# Altium schematic sheet Smartfin Main PCBA Motion.SchDoc
size Letter; TOCFontName: Consolas; TOCFontSize: 24; TOCFontColor: 0; TOCFontAttributes: 0; TOCMaxLinesInTable: 25; TOCVerticalOffset: 200; TOCHorizontalOffset: 500; TOCHorizontalSeparation: 800; TOCVerticalSeparation: 30; TOCHorizTableSize: 640; PageSetup: Record=PageOptions|CenterHorizontal=True|CenterVertical=True|PrintScale=0.96|XCorrection=1.00|YCorrection=1.00|PrintKind=0|BorderSize=5000000|LeftOffset=0|BottomOffset=0|Orientation=2|PaperLength=1000|PaperWidth=1000|Scale=100|PaperSource=7|PrintQuality=-4|MediaType=1|DitherType=10|PaperKind=11" x 17"|PrintScaleMode=1; SheetNumber: 4; SheetTotal: 8
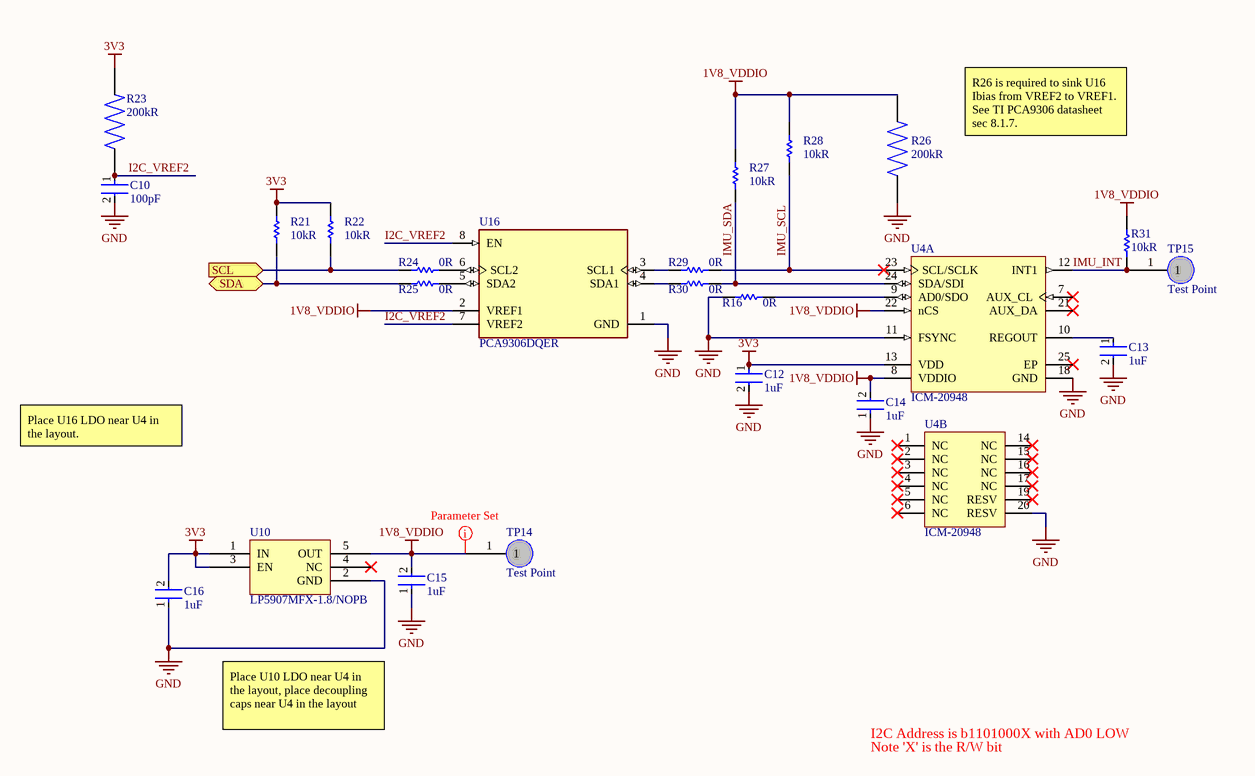
[diagram p0: Smartfin Main PCBA Motion.SchDoc]

## Parts
C10  value 100pF  [CAPC1005X06N]  (hidden comment: CC0402KRX7R9BB101)
C12  value 1uF  [FP-CC0402-IPC_C]  (hidden comment: cc0402krx5r6bb105)
C13  value 1uF  [FP-CC0402-IPC_C]  (hidden comment: cc0402krx5r6bb105)
C14  value 1uF  [FP-CC0402-IPC_C]  (hidden comment: cc0402krx5r6bb105)
C15  value 1uF  [FP-CC0402-IPC_C]  (hidden comment: cc0402krx5r6bb105)
C16  value 1uF  [FP-CC0402-IPC_C]  (hidden comment: cc0402krx5r6bb105)
R16  value 0R  [RESC1005X04N]  (hidden comment: RC0402JR-070RL)
R21  value 10kR  [RESC1005X04N]  (hidden comment: RC0402FR-0710KL)
R22  value 10kR  [RESC1005X04N]  (hidden comment: RC0402FR-0710KL)
R23  value 200kR  [RESC1005X04N]  (hidden comment: RC0402JR-07200KL)
R24  value 0R  [RESC1005X04N]  (hidden comment: RC0402JR-070RL)
R25  value 0R  [RESC1005X04N]  (hidden comment: RC0402JR-070RL)
R26  value 200kR  [RESC1005X04N]  (hidden comment: RC0402JR-07200KL)
R27  value 10kR  [RESC1005X04N]  (hidden comment: RC0402FR-0710KL)
R28  value 10kR  [RESC1005X04N]  (hidden comment: RC0402FR-0710KL)
R29  value 0R  [RESC1005X04N]  (hidden comment: RC0402JR-070RL)
R30  value 0R  [RESC1005X04N]  (hidden comment: RC0402JR-070RL)
R31  value 10kR  [RESC1005X04N]  (hidden comment: RC0402FR-0710KL)
TP14  Test Point  [New footprint 1]
TP15  Test Point  [New footprint 1]
U4  ICM-20948  [TDK-QFN-24_L]  (parts A,B of 2)
U10  LP5907MFX-1.8/NOPB  [SOT95P280X145-5N]
U16  PCA9306DQER  [FP-DQE0008A-MFG]

## Ports
SCL (in), SDA (bidir)

## Nets
1V8_VDDIO: C14.2 C15.2 R26.2 R27.2 R28.2 R31.2 TP14.1 U4.8(VDDIO) U4.22(nCS) U10.5(OUT) U16.2(VREF1)
3V3: C12.1 C16.2 R21.2 R22.2 R23.2 U4.13(VDD) U10.1(IN) U10.3(EN)
GND: C10.2 C12.2 C13.2 C14.1 C15.1 C16.1 R16.1 R26.1 U4.11(FSYNC) U4.18(GND) U4.20(RESV) U10.2(GND) U16.1(GND)
I2C_VREF2: C10.1 R23.1 U16.7(VREF2) U16.8(EN)
IMU_INT: R31.1 TP15.1 U4.12(INT1)
IMU_SCL: R28.1 R29.2 U4.23(SCL/SCLK)
IMU_SDA: R27.1 R30.2 U4.24(SDA/SDI)
SCL: R22.1 R24.1 ; port SCL
SDA: R21.1 R25.1 ; port SDA
NetC13_1: C13.1 U4.10(REGOUT)
NetR16_2: R16.2 U4.9(AD0/SDO)
NetR24_2: R24.2 U16.6(SCL2)
NetR25_2: R25.2 U16.5(SDA2)
NetR29_1: R29.1 U16.3(SCL1)
NetR30_1: R30.1 U16.4(SDA1)

Not connected (* = marked no-connect by the designer): U4 1(NC)* 2(NC)* 3(NC)* 4(NC)* 5(NC)* 6(NC)* 7(AUX_CL)* 14(NC)* 15(NC)* 16(NC)* 17(NC)* 19(RESV)* 21(AUX_DA)* 25(EP)*; U10 4(NC)*

## Layout directives
rule Supply Nets [Voltage = 1.800]; net class POWER: 1V8_VDDIO

## Notes on the sheet
- R26 is required to sink U16 Ibias from VREF2 to VREF1. See TI PCA9306 datasheet sec 8.1.7.
- Place U16 LDO near U4 in the layout.
- Place U10 LDO near U4 in the layout, place decoupling caps near U4 in the layout
- I2C Address is b1101000X with AD0 LOW
- Note 'X' is the R/W bit

## Library data of the parts
C10 = YAGEO-CC0402KRX7R9BB101-3: Ceramic Capacitor, Multilayer, Ceramic, 50V, 10% +Tol, 10% -Tol, X7R, 15% TC, 0.0001uF, Surface Mount, 0402
C12-C16 = YAGEO-CC0402KRX5R6BB105-1: Ceramic Capacitor, Multilayer, Ceramic, 10V, 10% +Tol, 10% -Tol, X5R, 15% TC, 1uF, Surface Mount, 0402
R16 R24 R25 R29 R30 = YAGEO-RC0402JR-070RL-1: Metal Glaze/thick Film, 0.0625W, 0ohm, Surface Mount, 0402
R21 R22 R27 R28 R31 = CMP-002-000053-2: Fixed Resistor, Metal Glaze/thick Film, 0.0625W, 10000ohm, 50V, 1% +/-Tol, 100ppm/Cel, Surface Mount, 0402
R23 R26 = CMP-002-000016-2: Res Thick Film 0402 200K Ohm 5% 0.063W(1/16W) ?100ppm/C Molded SMD Paper T/R; MF: {'manufacturer': u'YAGEO'}; Component Type: Standard; Source: RC0402JR-07200KL.SchLib; MP: RC0402JR-07200KL; Pin Count: 2; Price: None; Availability: Unavailable; Package: None; Design Item ID: RC0402JR-07200KL
TP14 TP15 = CMP-00002-11
U4 = CMP-002-000006-5: 9-Axis MEMS MotionTracking Device Gyroscope/Accelerometer/Compass Digital Motion Processor 24-Pin QFN; Pin Count: 24; Component Type: Standard; Source: ICM-20948.SchLib; MP: ICM-20948; Package: None; Design Item ID: ICM-20948; Availability: Unavailable; Value: *; Price: None
U10 = CMP-002-000011-4: 250-mA, low-noise, high-PSRR, low-IQ, ultra-low-dropout voltage regulator with low-IQ and enable 5-SOT-23 -40 to 125; Qualification Status: Not Qualified; Adjustability: FIXED; Number of Outputs: 1; Output Voltage1-Min: 1.764V; Regulator Type: FIXED POSITIVE SINGLE OUTPUT LDO REGULATOR; Output Voltage1-Nom: 1.8V; Min Input Voltage: 2.2V; Output Voltage1-Max: 1.836V; Package Body Material: Plastic; Package Equivalence Code: TSOP5/6,.11,37; Dropout Voltage1-Max: 250mV; Output Current1-Max: 250mA; Max Supply Voltage: 5.5V; Voltage Tolerance-Max: 2%; Input Voltage Absolute-Max: 6V; Price: None; Design Item ID: LP5907MFX-1.8/NOPB; Component Type: Standard; Value: *; Pin Count: 5; Source: LP5907MFX-1.8_NOPB.SchLib; Availability: Unavailable; MP: LP5907MFX-1.8/NOPB; Package: None; Terminal Finish: Tin; Moisture Sensitivity Level: 1; Height - Seated (Max): 1.45mm; Packaging: Tape and Reel; Width: 1.6mm; Package Shape: Rectangular; Pins: 5; Terminal Pitch: 0.95mm; Operating Temperature, TJ-Min: -40°C; Case/Package: LSSOP; Terminal Form: Gull Wing; RoHS Compliant: Yes; JESD-609 Code: e3; Package Style: SMALL OUTLINE, LOW PROFILE, SHRINK PITCHMeter; JESD-30 Code: R-PDSO-G5; Channels: 1; Length: 2.9mm; Reach SVHC Compliant: Yes; Technology: CMOS; Peak Reflow Temperature (Cel): 260°C; Operating Temperature, TJ-Max: 125°C; Terminal Position: DUAL; Surface Mount: Yes
U16 = CMP-010-000000-10: 2-bit bidirectional I2C bus and SMBus voltage-level shifter 8-X2SON -40 to 85; MF: Texas Instruments; Channels: 2; Qualification Status: Not Qualified; Max Supply Voltage: 5V; Min Supply Voltage: 0V; Package Body Material: Plastic; Interface IC Type: INTERFACE CIRCUIT; Value: *; MP: PCA9306DQER; Design Item ID: PCA9306DQER; Pin Count: 8; SnapEDA_Link: https://www.snapeda.com/parts/PCA9306DQER/Texas%20Instruments/view-part/39064/?ref=snap; Package: X2SON-8 Texas Instruments; Mouser-Purchase-URL: https://snapeda.com/shop?store=Mouser&id=39064; Source: PCA9306DQER.SchLib; Texas_Instruments-Purchase-URL: https://snapeda.com/shop?store=Texas+Instruments&id=39064; Availability: Warning; Component Type: Standard; Price: None; Length: 1.4mm; Surface Mount: Yes; Pins: 8; Width: 1mm; JESD-30 Code: R-PDSO-N8; Package Style: SMALL OUTLINE, VERY THIN PROFILEMeter; Temperature Grade: INDUSTRIAL; Min Operating Temperature: -40°C; Moisture Sensitivity Level: 1; Max Operating Temperature: 85°C; Terminal Position: DUAL; Terminal Pitch: 0.35mm; RoHS Compliant: Yes; Terminal Form: No Lead; Terminal Finish: Nickel; Package Shape: Rectangular; Case/Package: VSON; Peak Reflow Temperature (Cel): 260°C; Reach SVHC Compliant: Yes; JESD-609 Code: e4; Height - Seated (Max): 0.4mm